# Altium schematic sheet Master.SchDoc
size A; SheetNumber: 1; SheetTotal: 5
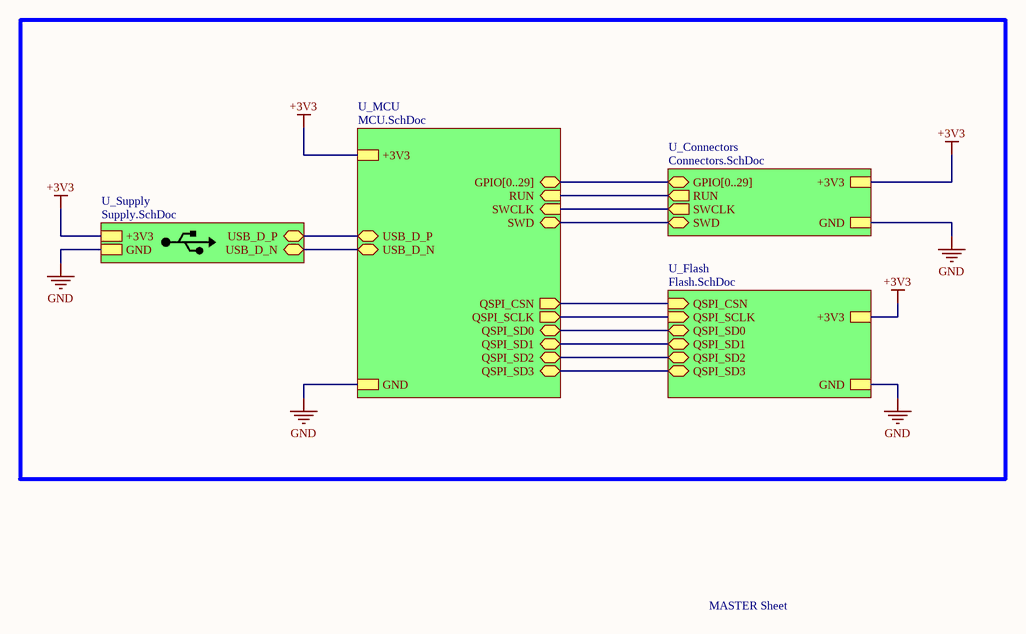
[diagram p0: Master.SchDoc]

## Sub-sheets
U_Connectors = Connectors.SchDoc: GPIO[0..29] (bidir), RUN (out), SWCLK (out), SWD (bidir), +3V3, GND
U_Flash = Flash.SchDoc: QSPI_CSN (in), QSPI_SCLK (in), QSPI_SD0 (bidir), QSPI_SD1 (bidir), QSPI_SD2 (bidir), QSPI_SD3 (bidir), +3V3, GND
U_MCU = MCU.SchDoc: USB_D_P (bidir), USB_D_N (bidir), GPIO[0..29] (bidir), RUN (in), SWCLK (in), SWD (bidir), QSPI_CSN (out), QSPI_SCLK (out), QSPI_SD0 (bidir), QSPI_SD1 (bidir), QSPI_SD2 (bidir), QSPI_SD3 (bidir), +3V3, GND
U_Supply = Supply.SchDoc: USB_D_P (bidir), USB_D_N (bidir), +3V3, GND

## Nets
+3V3: sheet U_Connectors/+3V3, sheet U_Flash/+3V3, sheet U_MCU/+3V3, sheet U_Supply/+3V3
GND: sheet U_Connectors/GND, sheet U_Flash/GND, sheet U_MCU/GND, sheet U_Supply/GND
(unnamed): sheet U_Connectors/RUN, sheet U_MCU/RUN
(unnamed): sheet U_Connectors/SWCLK, sheet U_MCU/SWCLK
(unnamed): sheet U_Connectors/SWD, sheet U_MCU/SWD
(unnamed): sheet U_Flash/QSPI_CSN, sheet U_MCU/QSPI_CSN
(unnamed): sheet U_Flash/QSPI_SCLK, sheet U_MCU/QSPI_SCLK
(unnamed): sheet U_Flash/QSPI_SD0, sheet U_MCU/QSPI_SD0
(unnamed): sheet U_Flash/QSPI_SD1, sheet U_MCU/QSPI_SD1
(unnamed): sheet U_Flash/QSPI_SD2, sheet U_MCU/QSPI_SD2
(unnamed): sheet U_Flash/QSPI_SD3, sheet U_MCU/QSPI_SD3
(unnamed): sheet U_MCU/USB_D_P, sheet U_Supply/USB_D_P
(unnamed): sheet U_MCU/USB_D_N, sheet U_Supply/USB_D_N

## Buses and harness runs
bus sheet U_Connectors/GPIO[0..29] = sheet U_MCU/GPIO[0..29]

## Notes on the sheet
- MASTER Sheet